# EAGLE design SparkFun_Audio_Jack_Breakout (EAGLE 7.2.0)
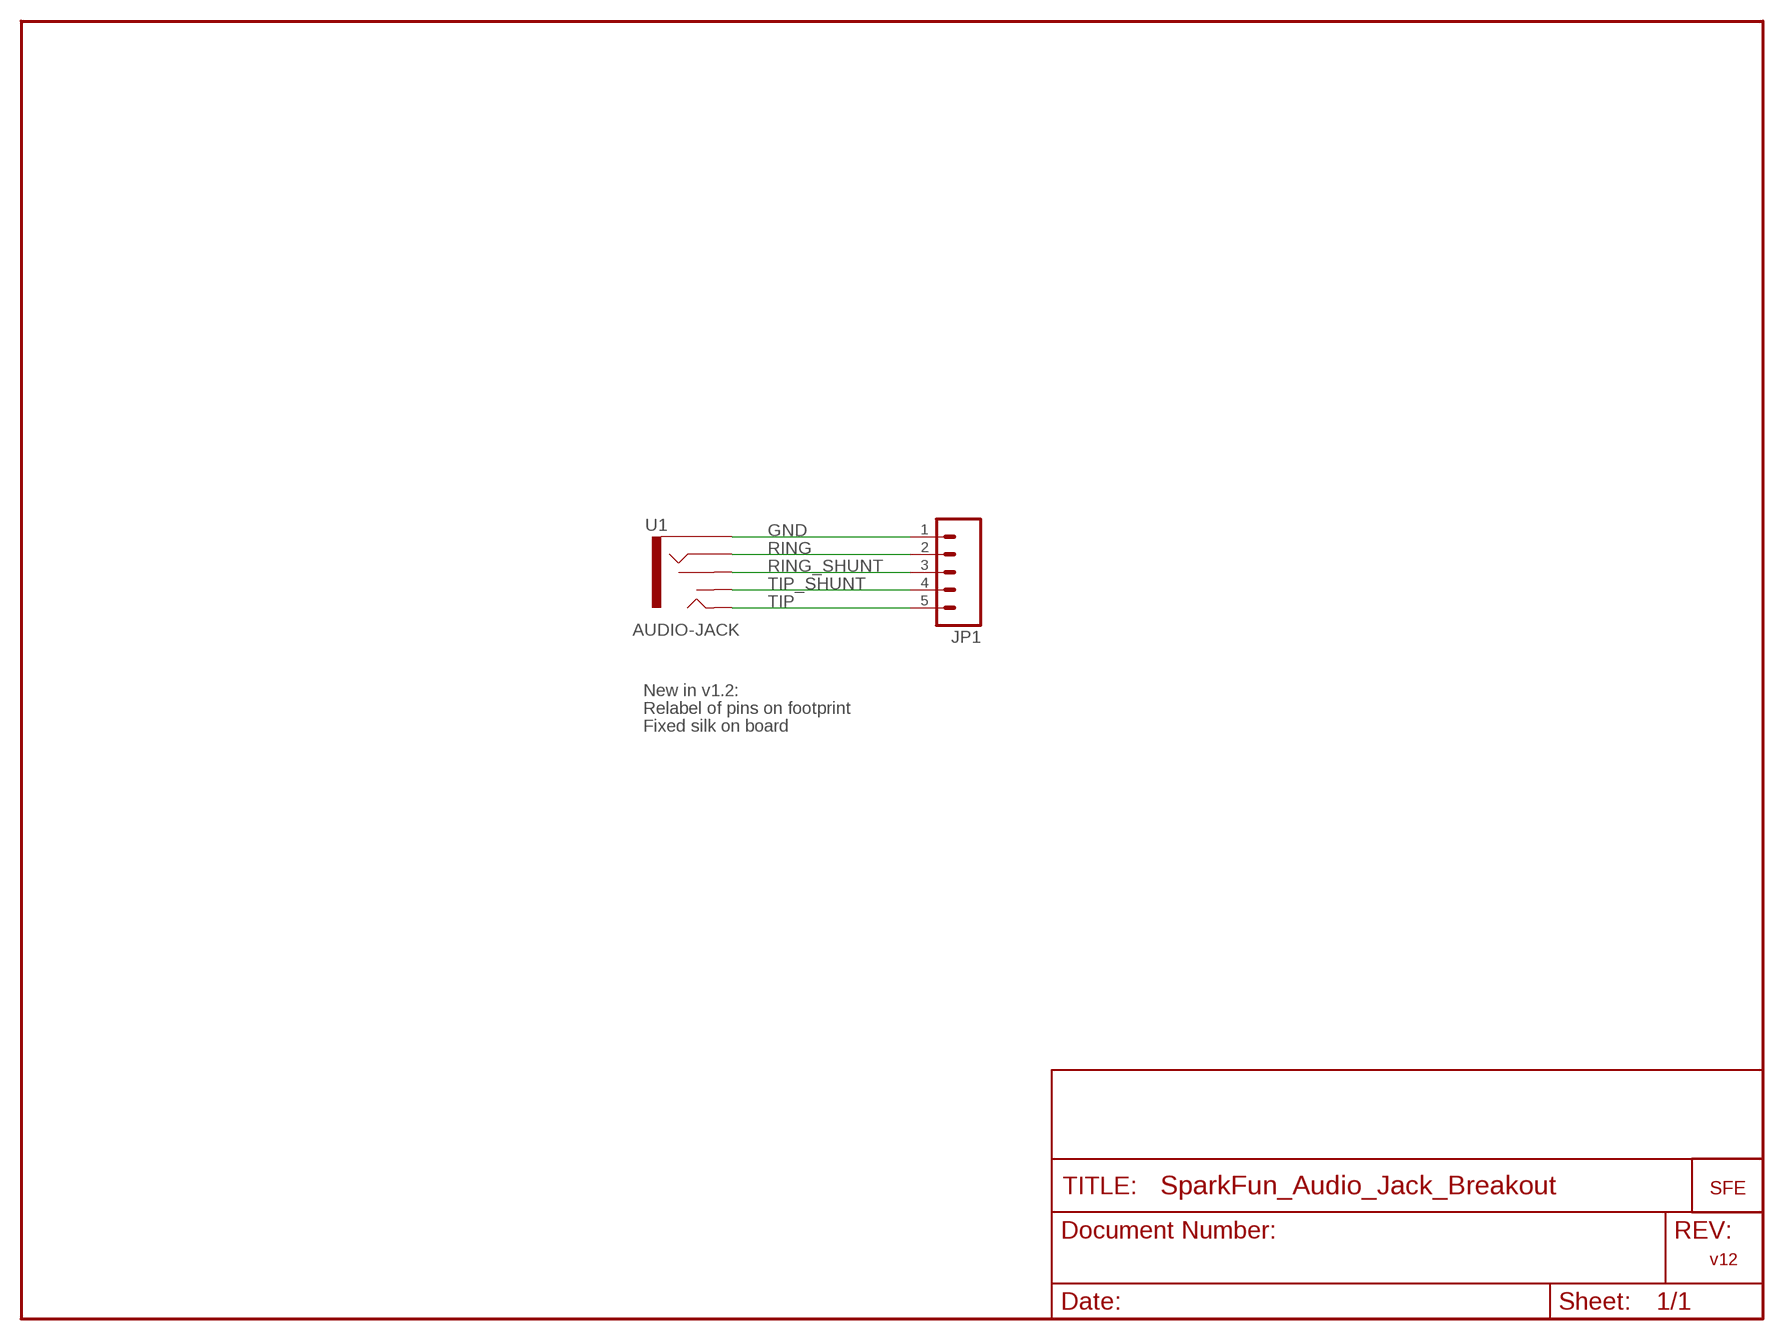
[diagram p0: schematic, sheet 1]

## Parts
JP1  M05PTH  [1X05]
U1  AUDIO-JACK  AUDIO-JACK2PTH  [AUDIO-JACK]
U$1  LOGO-SFESK  [SFE-LOGO-FLAME]

## Nets
GND: JP1.1 U1.SLEEVE
RING: JP1.2 U1.RING
RING_SHUNT: JP1.3 U1.RSH
TIP: JP1.5 U1.TIP
TIP_SHUNT: JP1.4 U1.TSH

## Notes on the sheet
- New in v1.2:
- Relabel of pins on footprint
- Fixed silk on board
- v12

## Library data of the parts
JP1 = SparkFun:M05: Header 5 Standard 5-pin 0.1" header. Use with straight break away headers (SKU : PRT-00116), right angle break away headers (PRT-00553), swiss pins (PRT-00743), machine pins (PRT-00117), and female headers (PRT-00115). Molex polarized connector foot print use with SKU : PRT-08230 with associated crimp pins and housings.
U1 = SparkFun:AUDIO-JACK2
U$1 = SparkFun:LOGO-SFE: Spark Fun Electronics PCB Logo This is the standard Spark Fun Electronics PCB logo.

## Board
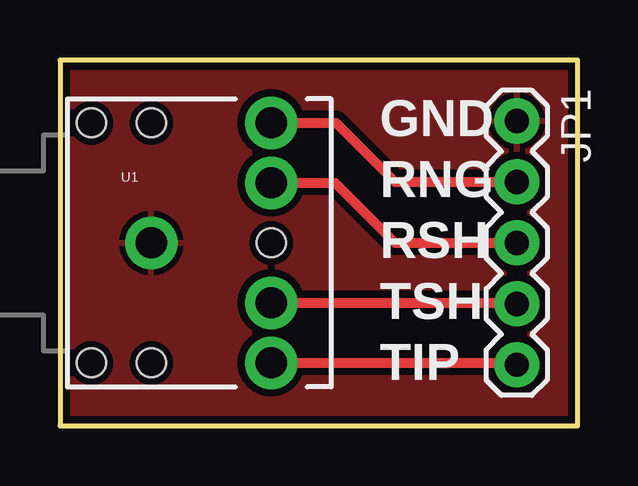
[diagram p1: board, top side]
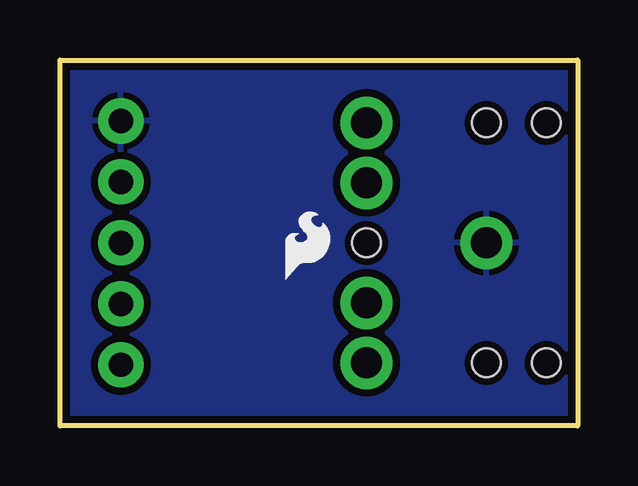
[diagram p2: board, bottom side, seen from below]

Size 21.59 x 15.24 mm. Coordinates in mm from the lower left corner, seen from the top.
Outline: 0,0 21.59,0 21.59,15.24 0,15.24 0,0
Copper layers (1*16): Top 0.0356mm / dielectric 1.5011mm / Bottom 0.0356mm
Design rules "default": minimum track width 8mil, minimum drill 20mil, track to track 8mil, track to pad 8mil, pad to pad 8mil, via to via 8mil, smd to smd 8mil, copper to edge 10mil, drill to drill 8mil, minimum pad ring 12mil, minimum via ring 10mil, stop-mask expansion 4mil, vias tented up to drill 20mil, thermal gap 10mil

### Footprints (pad centres in the part's own frame; a part is rotated, then mirrored left to right if it is on the bottom)
1X05 = drill 1.016 pad 1.88: 1 0,0; 2 2.54,0; 3 5.08,0; 4 7.62,0; 5 10.16,0
AUDIO-JACK = drill 1.3 pad 2.184: RING 5,5; RSH 5,2.5; SLEEVE 0,0; TIP 5,-5; TSH 5,-2.5 | hole 1.2: 0,5; -2.5,5; -2.5,-5; 0,-5; 5,0

### Placement (x,y rotation side)
JP1  19.05,12.7 270 top
U1  3.81,7.62 0 top
U$1  12.19,6.1 0 bottom

### Tracks (layer width: path | path; a pad name or v marks a point on that pad's centre or on a via)
GND
  pour Bottom (isolate 0.305): 0,15.24 0,0 21.59,0 21.59,15.24
  pour Top (isolate 0.305): 0,0 0,15.24 21.59,15.24 21.59,0
RING
  Top 0.406: U1.RING 11.51,12.62 13.97,10.16 JP1.2
RING_SHUNT
  Top 0.406: U1.RSH 11.47,10.12 13.97,7.62 JP1.3
TIP
  Top 0.406: U1.TIP 18.97,2.62 JP1.5
TIP_SHUNT
  Top 0.406: U1.TSH 19.01,5.12 JP1.4

### Text on the board
tPlace: GND | RNG | RSH | TSH | TIP